# Altium schematic sheet ADC.SchDoc
size A4; SheetNumber: 16; SheetTotal: 17
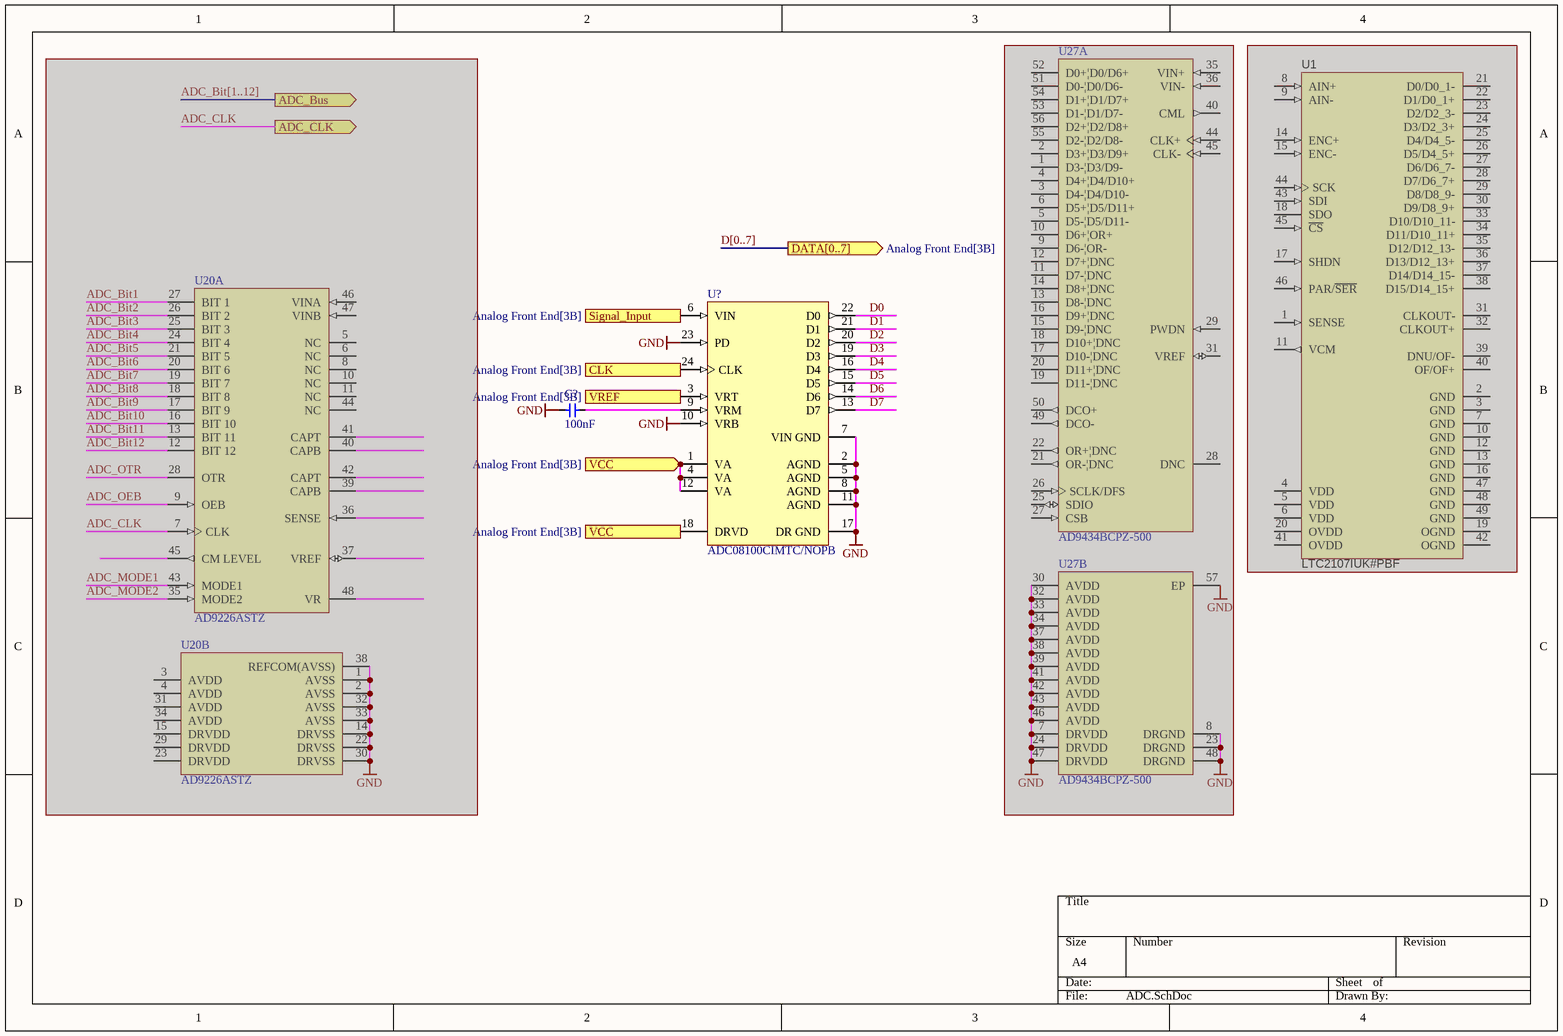
[diagram p0: ADC.SchDoc]

## Parts
C?  100nF  [0402_CAP]
U1  LTC2107IUK#PBF  [LT-UK-48_N]  (masked out: inside a compile mask, not in the netlist)
U20  AD9226ASTZ  [ST-48_N]  (parts A,B of 2)  (masked out: inside a compile mask, not in the netlist)
U27  AD9434BCPZ-500  [CP-56-5_M]  (parts A,B of 2)  (masked out: inside a compile mask, not in the netlist)
U?  ADC08100CIMTC/NOPB  [PW0024A_N]

## Ports
ADC_Bus (out), ADC_CLK (out), CLK (in, see Analog Front End[3B]), DATA[0..7] (out, see Analog Front End[3B]), Signal_Input (in, see Analog Front End[3B]), VCC (in, see Analog Front End[3B]), VREF (in, see Analog Front End[3B])

## Nets
GND: C?.1 U?.2(AGND) U?.5(AGND) U?.7(VIN_GND) U?.8(AGND) U?.10(VRB) U?.11(AGND) U?.17(DR_GND) U?.23(PD)
CLK: U?.24(CLK) ; port CLK
D0: U?.22(D0)
D1: U?.21(D1)
D2: U?.20(D2)
D3: U?.19(D3)
D4: U?.16(D4)
D5: U?.15(D5)
D6: U?.14(D6)
D7: U?.13(D7)
Signal_Input: U?.6(VIN) ; port Signal_Input
VCC: U?.1(VA) U?.4(VA) U?.12(VA) U?.18(DRVD) ; port VCC
VREF: U?.3(VRT) ; port VREF
NetC?_2: C?.2 U?.9(VRM)

## Buses and harness runs
bus D[0..7] = port DATA[0..7]

## Library data of the parts
C? = 电容-0402: Capacitor; Value: 0.1u
U1 = CMP-1532-00003-1: 210 Msps High Performance ADC, 16 Bits, 2.375 to 2.625 V, -40 to 85 degC, 48-Pin QFN (UK), RoHS, Tube; Manufacturer: Linear Technology; Number of Bits: 16; IVDD: 495.3 mA Typ.; BW-3dB: 800 MHz Typ.; DatasheetVersion: 04/2014; ComponentLink2Description: Datasheet; RoHS: TRUE; PackageVersion: Rev. C; Packing: Tube; Mounting Technology: Surface Mount; PartNumber: LTC2107IUK#PBF; ComponentLink2URL: http://cds.linear.com/docs/en/datasheet/2107f.pdf; ComponentLink3Description: Package Specification; VDD: 2.375 to 2.625 V; ComponentLink1Description: Manufacturer URL; PackageDescription: 48-Pin Plastic Quad Flat No-Lead Package, Body 7 x 7 mm, Pitch 0.5 mm; ComponentLink3URL: http://cds.linear.com/docs/en/packaging/QFN_48_05-08-1704.pdf; ComponentLink1URL: www.linear.com; Temperature Range: -40 to 85 degC
U20 = CMP-0313-00803-2: Single 12-Bit Analog-to-Digital Converter with Parallel Interface, 65MSPS, -40 to +85 degC, ST-48, Pb-Free, Tray; Generic Part Number: AD9226; Manufacturer: Analog Devices; Resolution (Bits): 12; Channels: 1; Interface: Par; Throughput Rate (SPS): 65M; ComponentLink3Description: Package Specification; Mounting Technology: Surface Mount; PartNumber: AD9226ASTZ; RoHS: Y; Packing: Tray; ComponentLink4Description: Product URL; PackageVersion: revA; ComponentLink1URL: http://www.analog.com/en/index.html; ComponentLink3URL: http://www.analog.com/static/imported-files/packages/PKG_PDF/LQFP%28ST%29/ST_48.pdf; PackageDescription: 48-Pin Thin Quad Flat Pack 0.5 mm Pitch; ComponentLink1Description: Manufacturer URL; DatasheetVersion: Rev.B; ComponentLink2Description: Datasheet; PackageReference: ST-48; ComponentLink2URL: http://www.analog.com/static/imported-files/data_sheets/AD9226.pdf; ComponentLink4URL: http://www.analog.com/en/analog-to-digital-converters/ad-converters/ad9226/products/product.html
U27 = CMP-0313-02358-2: Single 12-Bit Analog-to-Digital Converter with Parallel Interface, 1.8 V, 500MSPS, -40 to +85 degC, CP-56-5, Pb-Free, Tray; Generic Part Number: AD9434-500; Manufacturer: Analog Devices; Throughput Rate (SPS): 500M; Resolution (Bits): 12; Interface: Par; Channels: 1; PackageDescription: 56-Lead Lead Frame Chip Scale Package [LFCSP_VQ] 8 x 8 mm Body, Very Thin Quad; PartNumber: AD9434BCPZ-500; Packing: Tray; PackageReference: CP-56-5; Mounting Technology: Surface Mount; ComponentLink1URL: http://www.analog.com/en/index.html; ComponentLink3Description: Package Specification; ComponentLink4URL: http://www.analog.com/en/analog-to-digital-converters/ad-converters/ad9434/products/product.html; ComponentLink2Description: Datasheet; RoHS: Y; ComponentLink3URL: http://www.analog.com/static/imported-files/packages/PKG_PDF/LFCSP(CP)/CP-56/CP_56_5.pdf; ComponentLink2URL: http://www.analog.com/static/imported-files/data_sheets/AD9434.pdf; ComponentLink4Description: Product URL; Code_JEDEC: MO-220-WLLD-2; ComponentLink1Description: Manufacturer URL; PackageVersion: 072709-A; DatasheetVersion: Rev.A
U? = CMP-0054-00414-3: 8-Bit, 20 MSPS to 100 MSPS, 1.3 mW/Msps A/D Converter, 24-pin TSSOP, Pb-Free; Manufacturer: Texas Instruments; CompType: ADC IC; PowerWise: N; PackageTopMarking: NSUZXYTTE#*ADC08100*CIMTC; Code_JEDEC: MO-153-AD; PackageReference: PW0024A; PackageDescription: Molded TSSOP, Jedec, 7.8 x 4.4 x 0.9mm Body, 24 Lead, 0.65mm Pitch; ComponentLink1URL: http://www.ti.com/general/docs/lit/getliterature.tsp?genericPartNumber=ADC08100&fileType=pdf; ComponentLink1Description: Datasheet URL; PinCount: 24; RoHS: Y